# Altium schematic sheet power.SchDoc
size A4; SheetNumber: 3; SheetTotal: 3
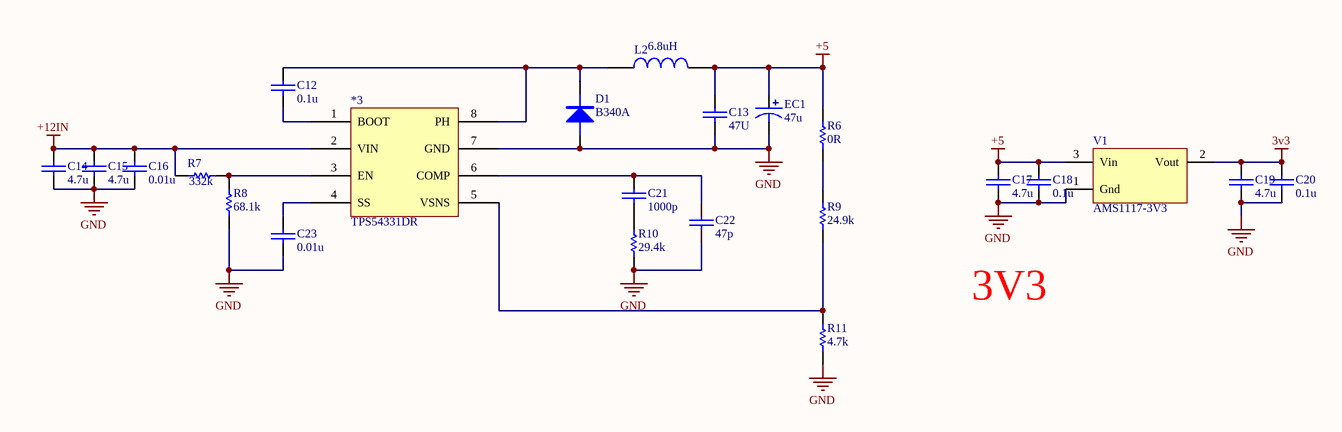
[diagram p0: power.SchDoc]

## Parts
*3  TPS54331DR  [SOIC-8]
C12  0.1u  [0603C]
C13  47U  [0603C]
C14  4.7u  [0603C]
C15  4.7u  [0603C]
C16  0.01u  [0603C]
C17  4.7u  [0603C]
C18  0.1u  [0603C]
C19  4.7u  [0603C]
C20  0.1u  [0603C]
C21  1000p  [0603C]
C22  47p  [0603C]
C23  0.01u  [0603C]
D1  B340A  [SMA/DO-214AC]
EC1  47u  [SMD-EC6.3X6.3X10]
L2  6.8uH  [L-SMD-0630]
R6  0R  [0603R]
R7  332k  [0603R]
R8  68.1k  [0603R]
R9  24.9k  [0603R]
R10  29.4k  [0603R]
R11  4.7k  [0603R]
V1  AMS1117-3V3  [SOT223_L]

## Nets
3v3: C19.2 C20.2 V1.2(Vout)
+5: C13.2 C17.2 C18.2 EC1.1 L2.2 R6.2 V1.3(Vin)
+12IN: *3.2(VIN) C14.2 C15.2 C16.2 R7.2
GND: *3.7(GND) C13.1 C14.1 C15.1 C16.1 C17.1 C18.1 C19.1 C20.1 C22.1 C23.1 D1.A EC1.2 R8.1 R10.1 R11.1 V1.1(Gnd)
Net*3_1: *3.1(BOOT) C12.1
Net*3_3: *3.3(EN) R7.1 R8.2
Net*3_4: *3.4(SS) C23.2
Net*3_5: *3.5(VSNS) R9.1 R11.2
Net*3_6: *3.6(COMP) C21.2 C22.2
Net*3_8: *3.8(PH) C12.2 D1.K L2.1
NetC21_1: C21.1 R10.2
NetR6_1: R6.1 R9.2

## Notes on the sheet
- 3V3

## Library data of the parts
*3 = TPS54331DR: 降压型DC-DC
C12-C23 = CAP: 无极性电容
D1 = DIODE: 普通二极管
EC1 = ECAP: 贴片电解电容
L2 = L: INDUCTOR
R6-R11 = RES: 电阻
V1 = AMS1117: LDO; BOM名称: 稳压芯片; 封装库来自淘宝卖家：黄晶宝石: 其他店铺购入的买家，请立即申请退款，本店现金奖励200~1000元